# EAGLE schematic EEZ CF-DIC block diagram r5B7 (EAGLE 7.2.0)
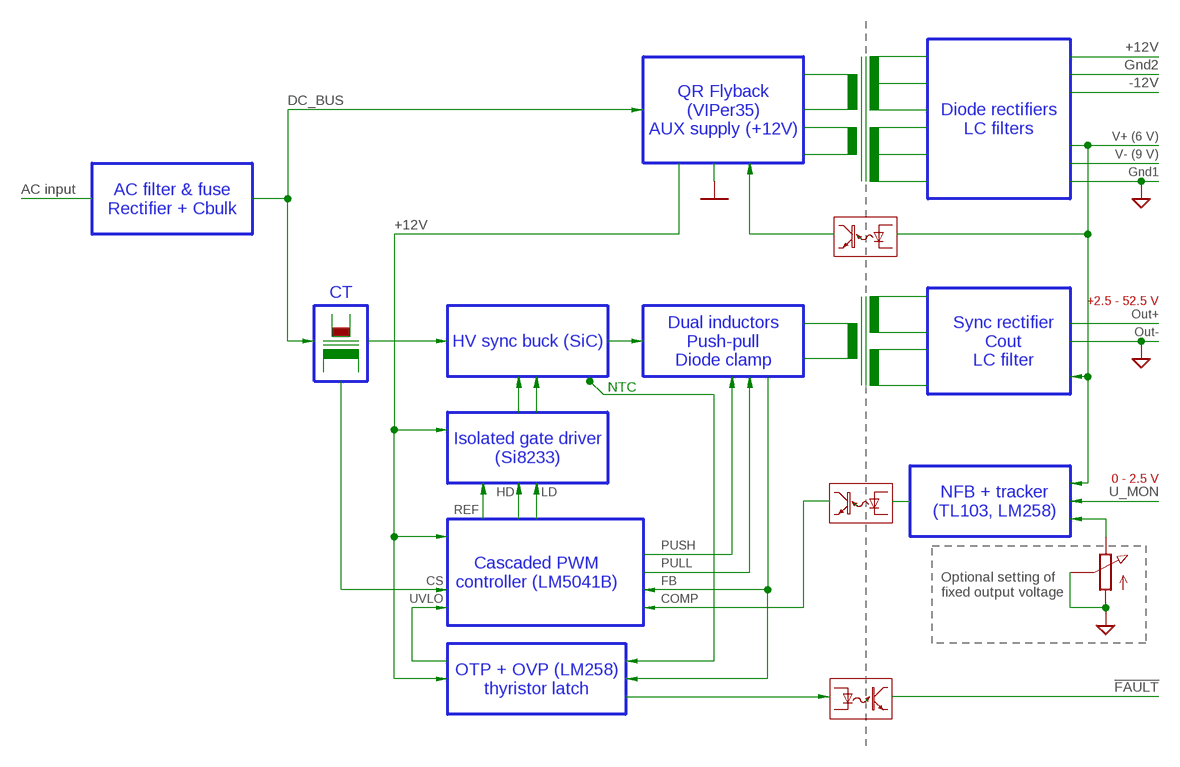
[diagram p0: schematic, sheet 1]

## Parts
P1  POTENTIOMETER  [BOURNS_POT91]

## Nets
GND: P1.2(S) P1.3(A)
N$71: P1.1(E)

## Notes on the sheet
- +12V
- Gnd2
- -12V
- DC_BUS
- QR Flyback
  (VIPer35)
  AUX supply (+12V)
- Diode rectifiers
  LC filters
- V+ (6 V)
- V- (9 V)
- Gnd1
- AC input
- AC filter & fuse
  Rectifier + Cbulk
- +12V
- CT
- +2.5 - 52.5 V
- Out+
- Out-
- HV sync buck (SiC)
- Dual inductors
  Push-pull
  Diode clamp
- Sync rectifier
  Cout
  LC filter
- NTC
- Isolated gate driver
  (Si8233)
- 0 - 2.5 V
- HD | LD | U_MON
- NFB + tracker
  (TL103, LM258)
- REF
- PUSH
- PULL
- Cascaded PWM
  controller (LM5041B)
- Optional setting of
  fixed output voltage
- CS | FB
- UVLO | COMP
- OTP + OVP (LM258)
  thyristor latch
- !FAULT

## Library data of the parts
P1 = EEZ_Lib1:POTENTIOMETER